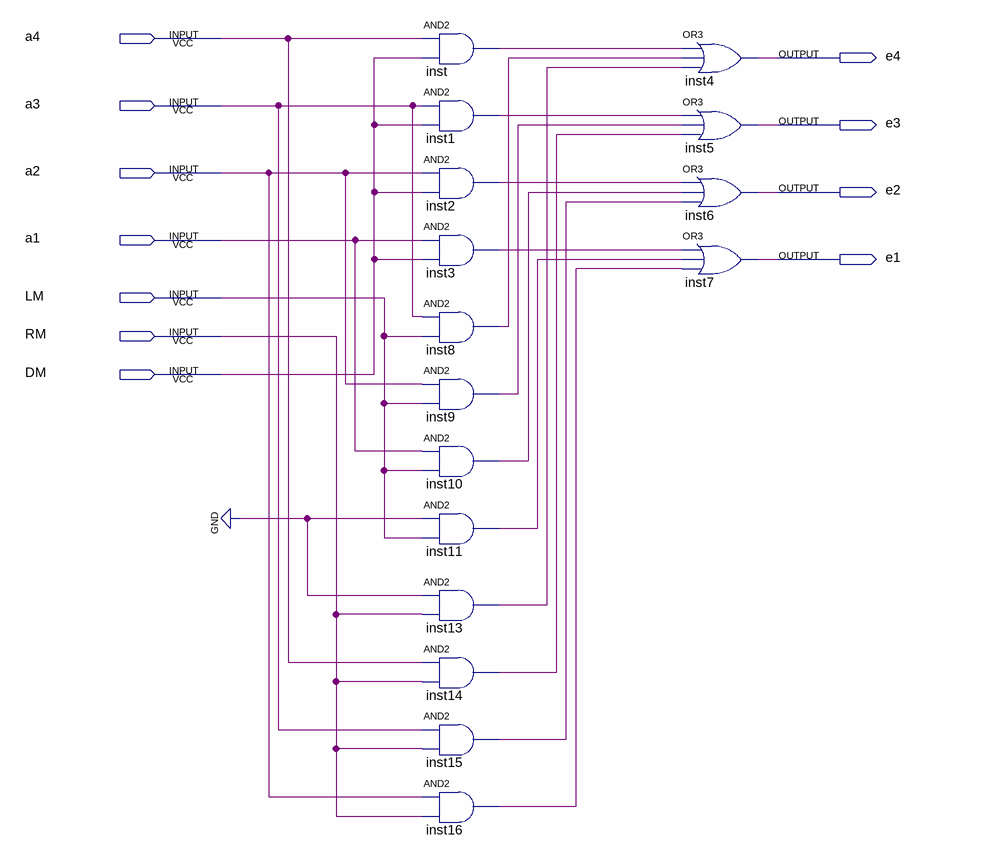
[diagram p0: schematic sheet]
// Quartus schematic experiment4.bdf as structural Verilog: 16 symbols, 11 pins
module experiment4 (
  input  a4,
  input  a3,
  input  a2,
  input  a1,
  input  LM,
  input  RM,
  input  DM,
  output e4,
  output e3,
  output e2,
  output e1
);

  wire inst1_out, inst2_out, inst3_out, inst8_out, inst9_out, inst10_out, inst11_out, inst13_out, inst14_out,
       inst15_out, inst16_out, inst_out;

  and inst (inst_out, a4, DM);
  and inst1 (inst1_out, a3, DM);
  and inst2 (inst2_out, a2, DM);
  and inst3 (inst3_out, a1, DM);
  and inst8 (inst8_out, a3, LM);
  and inst9 (inst9_out, a2, LM);
  and inst10 (inst10_out, a1, LM);
  and inst11 (inst11_out, 1'b0, LM);
  and inst13 (inst13_out, 1'b0, RM);
  and inst14 (inst14_out, a4, RM);
  and inst15 (inst15_out, a3, RM);
  and inst16 (inst16_out, a2, RM);
  or inst4 (e4, inst_out, inst8_out, inst13_out);
  or inst5 (e3, inst1_out, inst9_out, inst14_out);
  or inst6 (e2, inst2_out, inst10_out, inst15_out);
  or inst7 (e1, inst3_out, inst11_out, inst16_out);
endmodule
